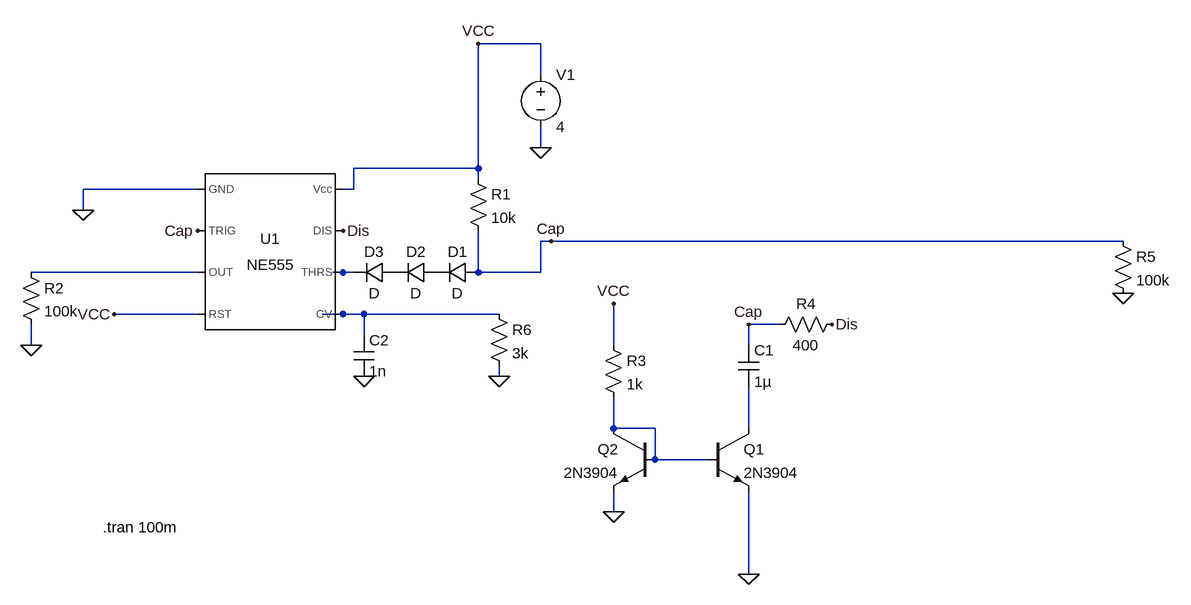
[diagram p0: schematic relaxation_oscillator_research.asc]
relaxation_oscillator_research.asc, the LTspice schematic file:
Version 4
SHEET 1 1116 692
WIRE 144 -144 48 -144
WIRE 144 -96 144 -144
WIRE 144 16 144 -16
WIRE 48 48 48 -144
WIRE 48 48 -144 48
WIRE 48 64 48 48
WIRE -384 80 -560 80
WIRE -144 80 -144 48
WIRE -144 80 -160 80
WIRE -560 112 -560 80
WIRE 160 160 144 160
WIRE 1040 160 160 160
WIRE -384 208 -640 208
WIRE -160 208 -176 208
WIRE -144 208 -160 208
WIRE 48 208 48 144
WIRE 144 208 144 160
WIRE 144 208 48 208
WIRE -384 272 -512 272
WIRE -160 272 -192 272
WIRE -128 272 -160 272
WIRE 80 272 -128 272
WIRE 512 288 464 288
WIRE -128 304 -128 272
WIRE -640 320 -640 288
WIRE 256 320 256 256
WIRE 464 320 464 288
WIRE 80 368 80 352
WIRE 256 448 256 400
WIRE 320 448 256 448
WIRE 464 448 464 384
WIRE 320 496 320 448
WIRE 400 496 320 496
WIRE 256 576 256 544
WIRE 464 672 464 544
FLAG 144 16 0
FLAG -560 112 0
FLAG 48 -144 VCC
FLAG -512 272 VCC
FLAG -384 144 Cap
FLAG 160 160 Cap
FLAG -128 368 0
FLAG 256 576 0
FLAG 256 256 VCC
FLAG -640 320 0
FLAG 464 672 0
FLAG -160 144 Dis
FLAG 592 288 Dis
FLAG 464 288 Cap
FLAG 1040 240 0
FLAG 80 368 0
SYMBOL Misc\\NE555 -272 176 R0
SYMATTR InstName U1
SYMBOL voltage 144 -112 R0
WINDOW 123 0 0 Left 2
WINDOW 39 0 0 Left 2
SYMATTR InstName V1
SYMATTR Value 4
SYMBOL res 32 48 R0
SYMATTR InstName R1
SYMATTR Value 10k
SYMBOL res -656 192 R0
SYMATTR InstName R2
SYMATTR Value 100k
SYMBOL cap -144 304 R0
SYMATTR InstName C2
SYMATTR Value 1n
SYMBOL npn 400 448 R0
SYMATTR InstName Q1
SYMATTR Value 2N3904
SYMBOL npn 320 448 M0
SYMATTR InstName Q2
SYMATTR Value 2N3904
SYMBOL res 240 304 R0
SYMATTR InstName R3
SYMATTR Value 1k
SYMBOL cap 448 320 R0
SYMATTR InstName C1
SYMATTR Value 1µ
SYMBOL res 608 272 R90
WINDOW 0 0 56 VBottom 2
WINDOW 3 32 56 VTop 2
SYMATTR InstName R4
SYMATTR Value 400
SYMBOL res 1024 144 R0
SYMATTR InstName R5
SYMATTR Value 100k
SYMBOL diode 48 192 R90
WINDOW 0 0 32 VBottom 2
WINDOW 3 32 32 VTop 2
SYMATTR InstName D1
SYMBOL res 64 256 R0
SYMATTR InstName R6
SYMATTR Value 3k
SYMBOL diode -16 192 R90
WINDOW 0 0 32 VBottom 2
WINDOW 3 32 32 VTop 2
SYMATTR InstName D2
SYMBOL diode -80 192 R90
WINDOW 0 0 32 VBottom 2
WINDOW 3 32 32 VTop 2
SYMATTR InstName D3
TEXT -530 600 Left 2 !.tran 100m

The netlist it stands for:
* relaxation_oscillator_research.asc
XU1 0 Cap N001 VCC N003 N002 Dis VCC NE555  ; pins GND TRIG OUT RST CV THRS DIS Vcc
V1 VCC 0 4
R1 VCC Cap 10k
R2 N001 0 100k
C2 N003 0 1n
Q1 N005 N004 0 0 2N3904
Q2 N004 N004 0 0 2N3904
R3 VCC N004 1k
C1 Cap N005 1µ
R4 Dis Cap 400
R5 Cap 0 100k
D1 Cap P001 D
R6 N003 0 3k
D2 P001 P002 D
D3 P002 N002 D
.model D D
.lib standard.dio
.model NPN NPN
.model PNP PNP
.lib standard.bjt
.tran 100m
.lib NE555.sub
.backanno
.end